# Altium schematic sheet Sheet1.SchDoc
size A
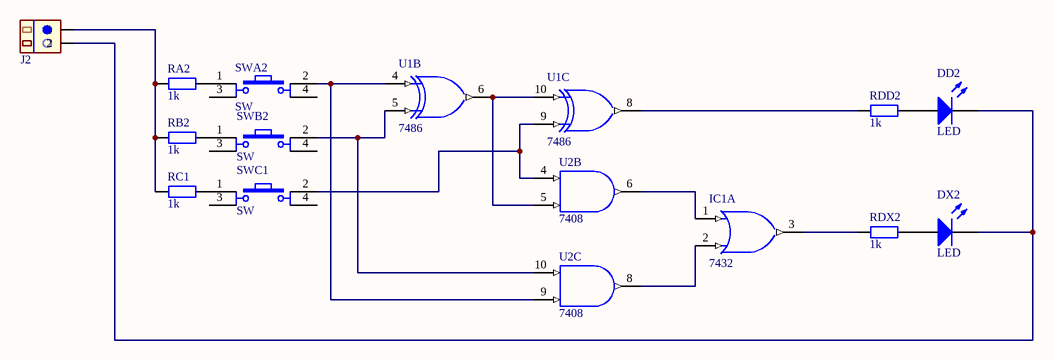
[diagram p0: Sheet1.SchDoc]

## Parts
DD2  LED  [LED-0 5mm RED]
DX2  LED  [LED-0 5mm BLUE]
IC1  7432  [DIP14/W0.3]  (part A of 4)
J2  CON.Domino2  [Domino 2M]  (value not drawn)
RA2  1k  [R1/2W]
RB2  1k  [R1/2W]
RC1  1k  [R1/2W]
RDD2  1k  [R1/2W]
RDX2  1k  [R1/2W]
SWA2  SW  [SW4]
SWB2  SW  [SW4]
SWC1  SW  [SW4]
U1  7486  [DIP-14]  (parts B,C of 4)
U2  7408  [DIP-14]  (parts B,C of 4)

## Nets
GND: IC1.7(GND) U1.7(GND) U2.7(GND)
VCC: IC1.14(VCC) U1.14(VCC) U2.14(VCC)
NetDD2_1: DD2.1(A) RDD2.2
NetDD2_2: DD2.2(K) DX2.2(K) J2.2
NetDX2_1: DX2.1(A) RDX2.2
NetIC1_1: IC1.1(A) U2.6(O)
NetIC1_2: IC1.2(B) U2.8(O)
NetIC1_3: IC1.3(Y) RDX2.1
NetJ2_1: J2.1 RA2.1 RB2.1 RC1.1
NetRA2_2: RA2.2 SWA2.1
NetRB2_2: RB2.2 SWB2.1
NetRC1_2: RC1.2 SWC1.1
NetRDD2_1: RDD2.1 U1.8(O)
NetSWA2_2: SWA2.2 U1.4(A) U2.9(B)
NetSWB2_2: SWB2.2 U1.5(B) U2.10(A)
NetSWC1_2: SWC1.2 U1.9(B) U2.4(A)
NetU1_6: U1.6(O) U1.10(A) U2.5(B)

Not connected (* = marked no-connect by the designer): SWA2 3 4; SWB2 3 4; SWC1 3 4

## Library data of the parts
DD2 DX2 = LED: Typical LED; Published: 8-Jun-2000; LatestRevisionDate: 08-Jul-2005; LatestRevisionNote: Mech Layer 1 removed.; PackageReference: LED-1; Publisher: Altium Limited
IC1 = 7432: Quad 2-Input OR Gate
J2 = CON.Domino2: 2 pins Domino Header; Publisher: Hoang Nguyen; ComponentLink1Description: Digikey Part link; ComponentLink2Description: Open DataSheet; ComponentLink2URL: H:\LIBRARY\LIBRARY.Datasheet\; Price: 2000VND
RA2 RB2 RC1 RDD2 RDX2 = R1/4W: Resistor 1/4W; Value: R1/4W - 1K
SWA2 SWB2 SWC1 = SW4: Switch button 4 pin; Value: Button chip 4 pin
U1 = 7486: 2-Input Exclusive-OR Gate; Published: 15-Apr-2002; LatestRevisionDate: 06-Jun-2005; LatestRevisionNote: Stylized 3D Model Added.; DatasheetVersion: Dec-1994; PackageVersion: 2000; PackageReference: N14A; Publisher: Altium Limited; PackageDescription: DIP; 14 Leads; Row Spacing 7.62 mm; Pitch 2.54 mm; ComponentLink1Description: Manufacturer Link; ComponentLink1URL: http://www.national.com/; ComponentLink2Description: Datasheet; ComponentLink2URL: http://www.fairchildsemi.com/ds/74/74F86.pdf; ComponentLink3Description: URL Link1; ComponentLink3URL: http://www.fairchildsemi.com/pf/74/74F86.html
U2 = 7408: Quad 2-Input AND Gate; Published: 15-Apr-2002; LatestRevisionDate: 06-Jun-2005; LatestRevisionNote: Stylized 3D Model Added.; DatasheetVersion: Dec-1994; PackageVersion: 2000; PackageReference: N14A; Publisher: Altium Limited; PackageDescription: DIP; 14 Leads; Row Spacing 7.62 mm; Pitch 2.54 mm; ComponentLink1Description: Manufacturer Link; ComponentLink1URL: http://www.national.com/; ComponentLink2Description: Datasheet; ComponentLink2URL: http://www.fairchildsemi.com/ds/74/74F08.pdf; ComponentLink3Description: URL Link1; ComponentLink3URL: http://www.fairchildsemi.com/pf/74/74F08.html